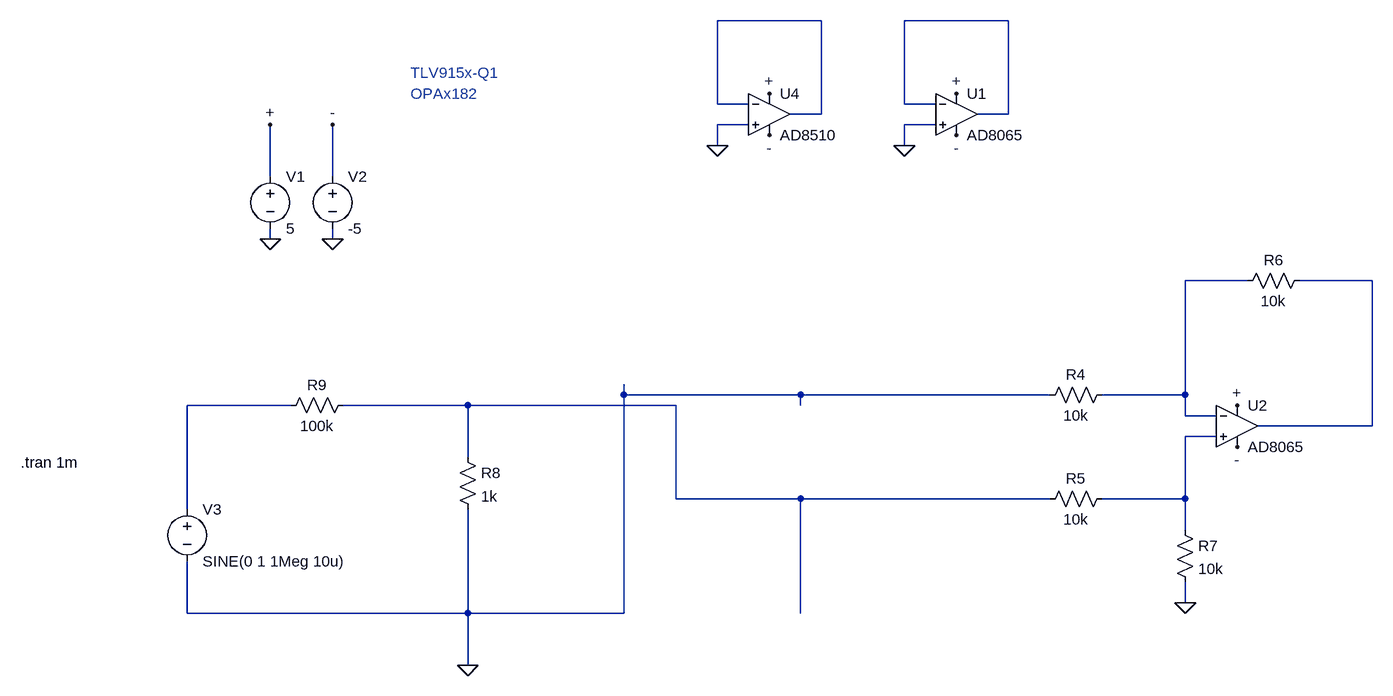
[diagram p0: schematic instrumentalAmplifier.asc]
instrumentalAmplifier.asc, the LTspice schematic file:
Version 4
SHEET 1 1888 932
WIRE 928 -144 768 -144
WIRE 1216 -144 1056 -144
WIRE 768 -16 768 -144
WIRE 816 -16 768 -16
WIRE 1056 -16 1056 -144
WIRE 1104 -16 1056 -16
WIRE 928 0 928 -144
WIRE 928 0 880 0
WIRE 1216 0 1216 -144
WIRE 1216 0 1168 0
WIRE 816 16 768 16
WIRE 1104 16 1056 16
WIRE 768 48 768 16
WIRE 1056 48 1056 16
WIRE 80 96 80 16
WIRE 176 96 176 16
WIRE 80 192 80 176
WIRE 176 192 176 176
WIRE 1584 256 1488 256
WIRE 1776 256 1664 256
WIRE 624 432 624 416
WIRE 896 432 624 432
WIRE 1280 432 896 432
WIRE 1488 432 1488 256
WIRE 1488 432 1360 432
WIRE 112 448 -48 448
WIRE 384 448 192 448
WIRE 704 448 384 448
WIRE 896 448 896 432
WIRE 1488 464 1488 432
WIRE 1536 464 1488 464
WIRE 1776 480 1776 256
WIRE 1776 480 1600 480
WIRE 1536 496 1488 496
WIRE 384 528 384 448
WIRE 704 592 704 448
WIRE 896 592 704 592
WIRE 1280 592 896 592
WIRE 1488 592 1488 496
WIRE 1488 592 1360 592
WIRE -48 608 -48 448
WIRE 1488 640 1488 592
WIRE 1488 752 1488 720
WIRE -48 768 -48 688
WIRE 384 768 384 608
WIRE 384 768 -48 768
WIRE 624 768 624 432
WIRE 624 768 384 768
WIRE 896 768 896 592
WIRE 384 848 384 768
FLAG 80 192 0
FLAG 176 192 0
FLAG 1488 752 0
FLAG 768 48 0
FLAG 1056 48 0
FLAG 80 16 +
FLAG 1568 448 +
FLAG 848 -32 +
FLAG 1568 512 -
FLAG 848 32 -
FLAG 176 16 -
FLAG 384 848 0
FLAG 1136 -32 +
FLAG 1136 32 -
SYMBOL voltage 80 80 R0
WINDOW 123 0 0 Left 0
WINDOW 39 0 0 Left 0
SYMATTR InstName V1
SYMATTR Value 5
SYMBOL voltage 176 80 R0
WINDOW 123 0 0 Left 0
WINDOW 39 0 0 Left 0
SYMATTR InstName V2
SYMATTR Value -5
SYMBOL voltage -48 592 R0
WINDOW 123 0 0 Left 0
WINDOW 39 0 0 Left 0
SYMATTR InstName V3
SYMATTR Value SINE(0 1 1Meg 10u)
SYMBOL res 1376 416 R90
WINDOW 0 0 56 VBottom 2
WINDOW 3 32 56 VTop 2
SYMATTR InstName R4
SYMATTR Value 10k
SYMBOL res 1376 576 R90
WINDOW 0 0 56 VBottom 2
WINDOW 3 32 56 VTop 2
SYMATTR InstName R5
SYMATTR Value 10k
SYMBOL res 1680 240 R90
WINDOW 0 0 56 VBottom 2
WINDOW 3 32 56 VTop 2
SYMATTR InstName R6
SYMATTR Value 10k
SYMBOL res 1472 624 R0
SYMATTR InstName R7
SYMATTR Value 10k
SYMBOL res 368 512 R0
SYMATTR InstName R8
SYMATTR Value 1k
SYMBOL res 208 432 R90
WINDOW 0 0 56 VBottom 2
WINDOW 3 32 56 VTop 2
SYMATTR InstName R9
SYMATTR Value 100k
SYMBOL Opamps\\AD8510 848 -64 R0
SYMATTR InstName U4
SYMBOL Opamps\\AD8065 1568 416 R0
SYMATTR InstName U2
SYMBOL Opamps\\AD8065 1136 -64 R0
SYMATTR InstName U1
TEXT 296 -64 Left 2 ;TLV915x-Q1
TEXT 296 -32 Left 2 ;OPAx182
TEXT -304 536 Left 2 !.tran 1m

The netlist it stands for:
* instrumentalAmplifier.asc
V1 + 0 5
V2 - 0 -5
V3 N005 0 SINE(0 1 1Meg 10u)
R4 N003 0 10k
R5 N007 N006 10k
R6 N004 N003 10k
R7 N007 0 10k
R8 N006 0 1k
R9 N006 N005 100k
XU4 0 N001 + - N001 AD8510  ; pins In+ In- V+ V- OUT
XU2 N007 N003 + - N004 AD8065  ; pins In+ In- V+ V- OUT
XU1 0 N002 + - N002 AD8065  ; pins In+ In- V+ V- OUT
* TLV915x-Q1
* OPAx182
.tran 1m
.backanno
.end